# Altium schematic sheet Opto-Isolation_1.SchDoc
size A2 portrait; SheetNumber: 6; SheetTotal: 6
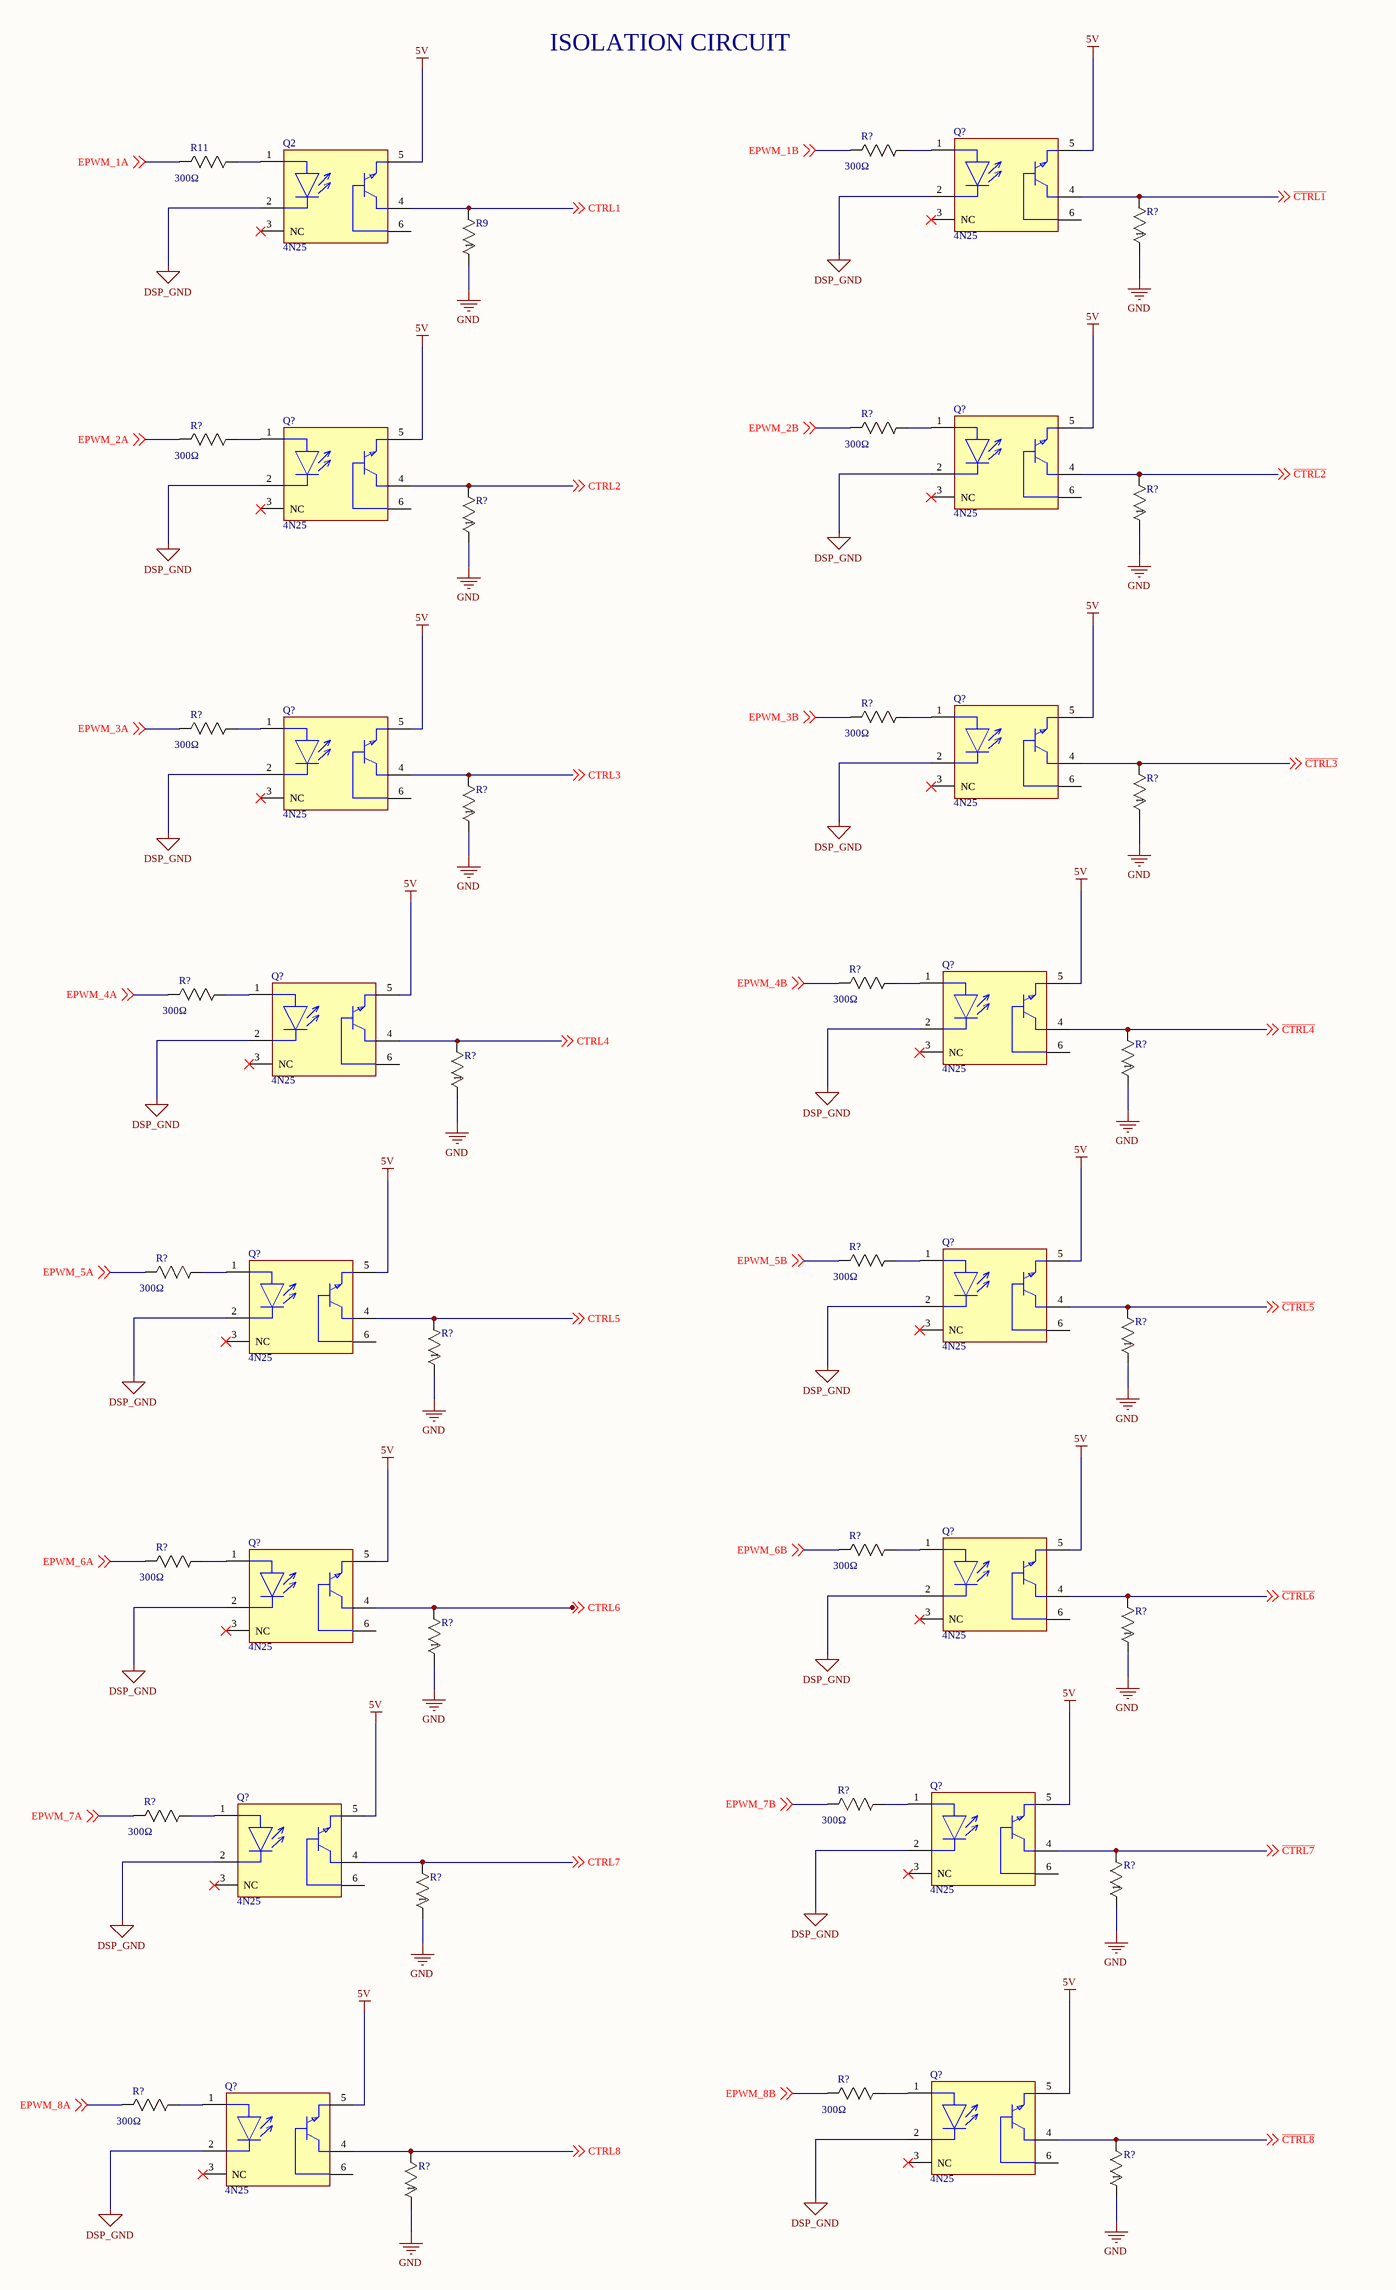
[diagram p0: Opto-Isolation_1.SchDoc]

## Parts
(Parts that share a designator on the sheet are numbered #1, #2 ... from top to bottom, then left to right.)
Q2  4N25  [FP-4N25-MFG]
Q?#1  4N25  [FP-4N25-MFG]
Q?#2  4N25  [FP-4N25-MFG]
Q?#3  4N25  [FP-4N25-MFG]
Q?#4  4N25  [FP-4N25-MFG]
Q?#5  4N25  [FP-4N25-MFG]
Q?#6  4N25  [FP-4N25-MFG]
Q?#7  4N25  [FP-4N25-MFG]
Q?#8  4N25  [FP-4N25-MFG]
Q?#9  4N25  [FP-4N25-MFG]
Q?#10  4N25  [FP-4N25-MFG]
Q?#11  4N25  [FP-4N25-MFG]
Q?#12  4N25  [FP-4N25-MFG]
Q?#13  4N25  [FP-4N25-MFG]
Q?#14  4N25  [FP-4N25-MFG]
Q?#15  4N25  [FP-4N25-MFG]
R9  AC07000001001JAC00  [RES_AC07_VIS]  (value not drawn)
R11  Resistance: 300Ω  [RES_AC03_VIS]  (hidden comment: AC03000003000JAC00)
R?#1  Resistance: 300Ω  [RES_AC03_VIS]  (hidden comment: AC03000003000JAC00)
R?#2  AC07000001001JAC00  [RES_AC07_VIS]  (value not drawn)
R?#3  Resistance: 300Ω  [RES_AC03_VIS]  (hidden comment: AC03000003000JAC00)
R?#4  Resistance: 300Ω  [RES_AC03_VIS]  (hidden comment: AC03000003000JAC00)
R?#5  AC07000001001JAC00  [RES_AC07_VIS]  (value not drawn)
R?#6  AC07000001001JAC00  [RES_AC07_VIS]  (value not drawn)
R?#7  Resistance: 300Ω  [RES_AC03_VIS]  (hidden comment: AC03000003000JAC00)
R?#8  Resistance: 300Ω  [RES_AC03_VIS]  (hidden comment: AC03000003000JAC00)
R?#9  AC07000001001JAC00  [RES_AC07_VIS]  (value not drawn)
R?#10  AC07000001001JAC00  [RES_AC07_VIS]  (value not drawn)
R?#11  Resistance: 300Ω  [RES_AC03_VIS]  (hidden comment: AC03000003000JAC00)
R?#12  Resistance: 300Ω  [RES_AC03_VIS]  (hidden comment: AC03000003000JAC00)
R?#13  AC07000001001JAC00  [RES_AC07_VIS]  (value not drawn)
R?#14  AC07000001001JAC00  [RES_AC07_VIS]  (value not drawn)
R?#15  Resistance: 300Ω  [RES_AC03_VIS]  (hidden comment: AC03000003000JAC00)
R?#16  Resistance: 300Ω  [RES_AC03_VIS]  (hidden comment: AC03000003000JAC00)
R?#17  AC07000001001JAC00  [RES_AC07_VIS]  (value not drawn)
R?#18  AC07000001001JAC00  [RES_AC07_VIS]  (value not drawn)
R?#19  Resistance: 300Ω  [RES_AC03_VIS]  (hidden comment: AC03000003000JAC00)
R?#20  Resistance: 300Ω  [RES_AC03_VIS]  (hidden comment: AC03000003000JAC00)
R?#21  AC07000001001JAC00  [RES_AC07_VIS]  (value not drawn)
R?#22  AC07000001001JAC00  [RES_AC07_VIS]  (value not drawn)
R?#23  Resistance: 300Ω  [RES_AC03_VIS]  (hidden comment: AC03000003000JAC00)
R?#24  Resistance: 300Ω  [RES_AC03_VIS]  (hidden comment: AC03000003000JAC00)
R?#25  AC07000001001JAC00  [RES_AC07_VIS]  (value not drawn)
R?#26  AC07000001001JAC00  [RES_AC07_VIS]  (value not drawn)
R?#27  Resistance: 300Ω  [RES_AC03_VIS]  (hidden comment: AC03000003000JAC00)
R?#28  Resistance: 300Ω  [RES_AC03_VIS]  (hidden comment: AC03000003000JAC00)
R?#29  AC07000001001JAC00  [RES_AC07_VIS]  (value not drawn)
R?#30  AC07000001001JAC00  [RES_AC07_VIS]  (value not drawn)

## Nets
5V: Q2.5(C) Q?#1.5(C) Q?#2.5(C) Q?#3.5(C) Q?#4.5(C) Q?#5.5(C) Q?#6.5(C) Q?#7.5(C) Q?#8.5(C) Q?#9.5(C) Q?#10.5(C) Q?#11.5(C) Q?#12.5(C) Q?#13.5(C) Q?#14.5(C) Q?#15.5(C)
DSP_GND: Q2.2(C) Q?#1.2(C) Q?#2.2(C) Q?#3.2(C) Q?#4.2(C) Q?#5.2(C) Q?#6.2(C) Q?#7.2(C) Q?#8.2(C) Q?#9.2(C) Q?#10.2(C) Q?#11.2(C) Q?#12.2(C) Q?#13.2(C) Q?#14.2(C) Q?#15.2(C)
GND: R9.1 R?#2.1 R?#5.1 R?#6.1 R?#9.1 R?#10.1 R?#13.1 R?#14.1 R?#17.1 R?#18.1 R?#21.1 R?#22.1 R?#25.1 R?#26.1 R?#29.1 R?#30.1
~{CTRL1}: Q?#1.4(E) R?#2.2 ; off-sheet ~{CTRL1}
~{CTRL2}: Q?#2.4(E) R?#5.2 ; off-sheet ~{CTRL2}
~{CTRL3}: Q?#4.4(E) R?#9.2 ; off-sheet ~{CTRL3}
~{CTRL4}: Q?#6.4(E) R?#13.2 ; off-sheet ~{CTRL4}
~{CTRL5}: Q?#8.4(E) R?#17.2 ; off-sheet ~{CTRL5}
~{CTRL6}: Q?#10.4(E) R?#21.2 ; off-sheet ~{CTRL6}
~{CTRL7}: Q?#12.4(E) R?#25.2 ; off-sheet ~{CTRL7}
~{CTRL8}: Q?#14.4(E) R?#29.2 ; off-sheet ~{CTRL8}
CTRL1: Q2.4(E) R9.2 ; off-sheet CTRL1
CTRL2: Q?#3.4(E) R?#6.2 ; off-sheet CTRL2
CTRL3: Q?#5.4(E) R?#10.2 ; off-sheet CTRL3
CTRL4: Q?#7.4(E) R?#14.2 ; off-sheet CTRL4
CTRL5: Q?#9.4(E) R?#18.2 ; off-sheet CTRL5
CTRL6: Q?#11.4(E) R?#22.2 ; off-sheet CTRL6
CTRL7: Q?#13.4(E) R?#26.2 ; off-sheet CTRL7
CTRL8: Q?#15.4(E) R?#30.2 ; off-sheet CTRL8
EPWM_1A: R11.1 ; off-sheet EPWM_1A
EPWM_1B: R?#1.1 ; off-sheet EPWM_1B
EPWM_2A: R?#4.1 ; off-sheet EPWM_2A
EPWM_2B: R?#3.1 ; off-sheet EPWM_2B
EPWM_3A: R?#8.1 ; off-sheet EPWM_3A
EPWM_3B: R?#7.1 ; off-sheet EPWM_3B
EPWM_4A: R?#12.1 ; off-sheet EPWM_4A
EPWM_4B: R?#11.1 ; off-sheet EPWM_4B
EPWM_5A: R?#16.1 ; off-sheet EPWM_5A
EPWM_5B: R?#15.1 ; off-sheet EPWM_5B
EPWM_6A: R?#20.1 ; off-sheet EPWM_6A
EPWM_6B: R?#19.1 ; off-sheet EPWM_6B
EPWM_7A: R?#24.1 ; off-sheet EPWM_7A
EPWM_7B: R?#23.1 ; off-sheet EPWM_7B
EPWM_8A: R?#28.1 ; off-sheet EPWM_8A
EPWM_8B: R?#27.1 ; off-sheet EPWM_8B
NetQ2_1: Q2.1(A) R11.2
NetQ?#1_1: Q?#1.1(A) R?#1.2
NetQ?#2_1: Q?#2.1(A) R?#3.2
NetQ?#3_1: Q?#3.1(A) R?#4.2
NetQ?#4_1: Q?#4.1(A) R?#7.2
NetQ?#5_1: Q?#5.1(A) R?#8.2
NetQ?#6_1: Q?#6.1(A) R?#11.2
NetQ?#7_1: Q?#7.1(A) R?#12.2
NetQ?#8_1: Q?#8.1(A) R?#15.2
NetQ?#9_1: Q?#9.1(A) R?#16.2
NetQ?#10_1: Q?#10.1(A) R?#19.2
NetQ?#11_1: Q?#11.1(A) R?#20.2
NetQ?#12_1: Q?#12.1(A) R?#23.2
NetQ?#13_1: Q?#13.1(A) R?#24.2
NetQ?#14_1: Q?#14.1(A) R?#27.2
NetQ?#15_1: Q?#15.1(A) R?#28.2

Not connected (* = marked no-connect by the designer): Q2 3(NC)* 6(B); Q?#1 3(NC)* 6(B); Q?#2 3(NC)* 6(B); Q?#3 3(NC)* 6(B); Q?#4 3(NC)* 6(B); Q?#5 3(NC)* 6(B); Q?#6 3(NC)* 6(B); Q?#7 3(NC)* 6(B); Q?#8 3(NC)* 6(B); Q?#9 3(NC)* 6(B); Q?#10 3(NC)* 6(B); Q?#11 3(NC)* 6(B); Q?#12 3(NC)* 6(B); Q?#13 3(NC)* 6(B); Q?#14 3(NC)* 6(B); Q?#15 3(NC)* 6(B)

## Notes on the sheet
- ISOLATION CIRCUIT

## Library data of the parts
Q2 Q?#1-Q?#15 = CMP-22018-000009-1: OPTOISO 2.5KV TRANS W/BASE 6DIP; Isolation Voltage: 5kV; Reverse Breakdown Voltage: 5V; Forward Voltage: 1.5V; Rise Time: 2us; Max Power Dissipation: 250mW; Collector Emitter Breakdown Voltage: 30V; Max Collector Current: 100mA; Collector Emitter Saturation Voltage: 500mV; Power Dissipation: 150mW; Number of Elements: 1; Forward Current: 60mA; Output Voltage: 70V; Input Type: DC; Max Input Current: 80mA; Input Current: 50mA; Current Transfer Ratio: 50%; Number of Pins: 6; Min Operating Temperature: -55°C; Radiation Hardening: No; Case/Package: PDIP; Fall Time: 2us; Lead Free: Lead Free; Series: -; Max Operating Temperature: 100°C; Output Current per Channel: 100mA; Number of Circuits: 1; Collector Emitter Voltage (VCEO): 30V; Isolation Voltage-Max: 5kV; Collector-emitter Voltage-Max: 500mV; Packaging: Rail/Tube; Mount: Through Hole; Package Quantity: 2000; Max Output Voltage: 30V; Number of Channels: 1
R9 R?#2 R?#5 R?#6 R?#9 R?#10 R?#13 R?#14 R?#17 R?#18 R?#21 R?#22 R?#25 R?#26 R?#29 R?#30 = CMP-00030-42824149-1: AC07000001001JAC00 1kΩ 7W -80ppm/℃~-10ppm/℃ ±5% -40℃~+275℃ Axial Leaded Through Hole Resistors ROHS; Temperature Coefficient: -80ppm/°C; Voltage Rating (DC): 84V; Tolerance: 5%; Military Standard: Not; RoHS: Compliant; Diameter: 7.5mm; Radiation Hardening: No; Lead Free: Lead Free; Max Power Dissipation: 7W; Contact Plating: Tin; Number of Terminations: 2; Length: 26mm; Thickness: 7.493mm; Case/Package: Axial; Min Operating Temperature: -40°C; Resistance: 1kΩ; Composition: Wirewound; NexarPartId: 42824149; Max Operating Temperature: 200°C; Voltage Rating: 84V; Number of Pins: 2; Power Rating: 7W; Packaging: Tape & Box (TB); Width: 7.49mm; Features: Flame Retardant Coating; Termination: Axial
R11 R?#1 R?#3 R?#4 R?#7 R?#8 R?#11 R?#12 R?#15 R?#16 R?#19 R?#20 R?#23 R?#24 R?#27 R?#28 = CMP-00030-39746760-1: AC03000003000JAC00 Res Wirewound 300 Ohm 5% 3W -80ppm/C to -10ppm/C Conformal AXL Thru-Hole Ammo Pack; Voltage Rating (DC): 30V; Lead Diameter: 800µm; Temperature Coefficient: -80ppm/°C; Max Operating Temperature: 275°C; Number of Pins: 2; Termination: Axial; Diameter: 4.8mm; Contact Plating: Tin; Packaging: Cut Tape (CT); Schedule B: 8533210080, 8533210080; Voltage Rating: 30V; Military Standard: Not; Max Power Dissipation: 3W; Composition: Wirewound; Power Rating: 3W; NexarPartId: 39746760; Tolerance: 5%; Case/Package: Axial; REACH SVHC: Unknown; Min Operating Temperature: -40°C; Thickness: 4.8006mm; Features: Flame Retardant Coating; Width: 4.8mm; Length: 13mm; RoHS: Compliant; Number of Terminations: 2